# Altium schematic sheet 1 top.SchDoc
size A4; SheetNumber: 1; SheetTotal: 4
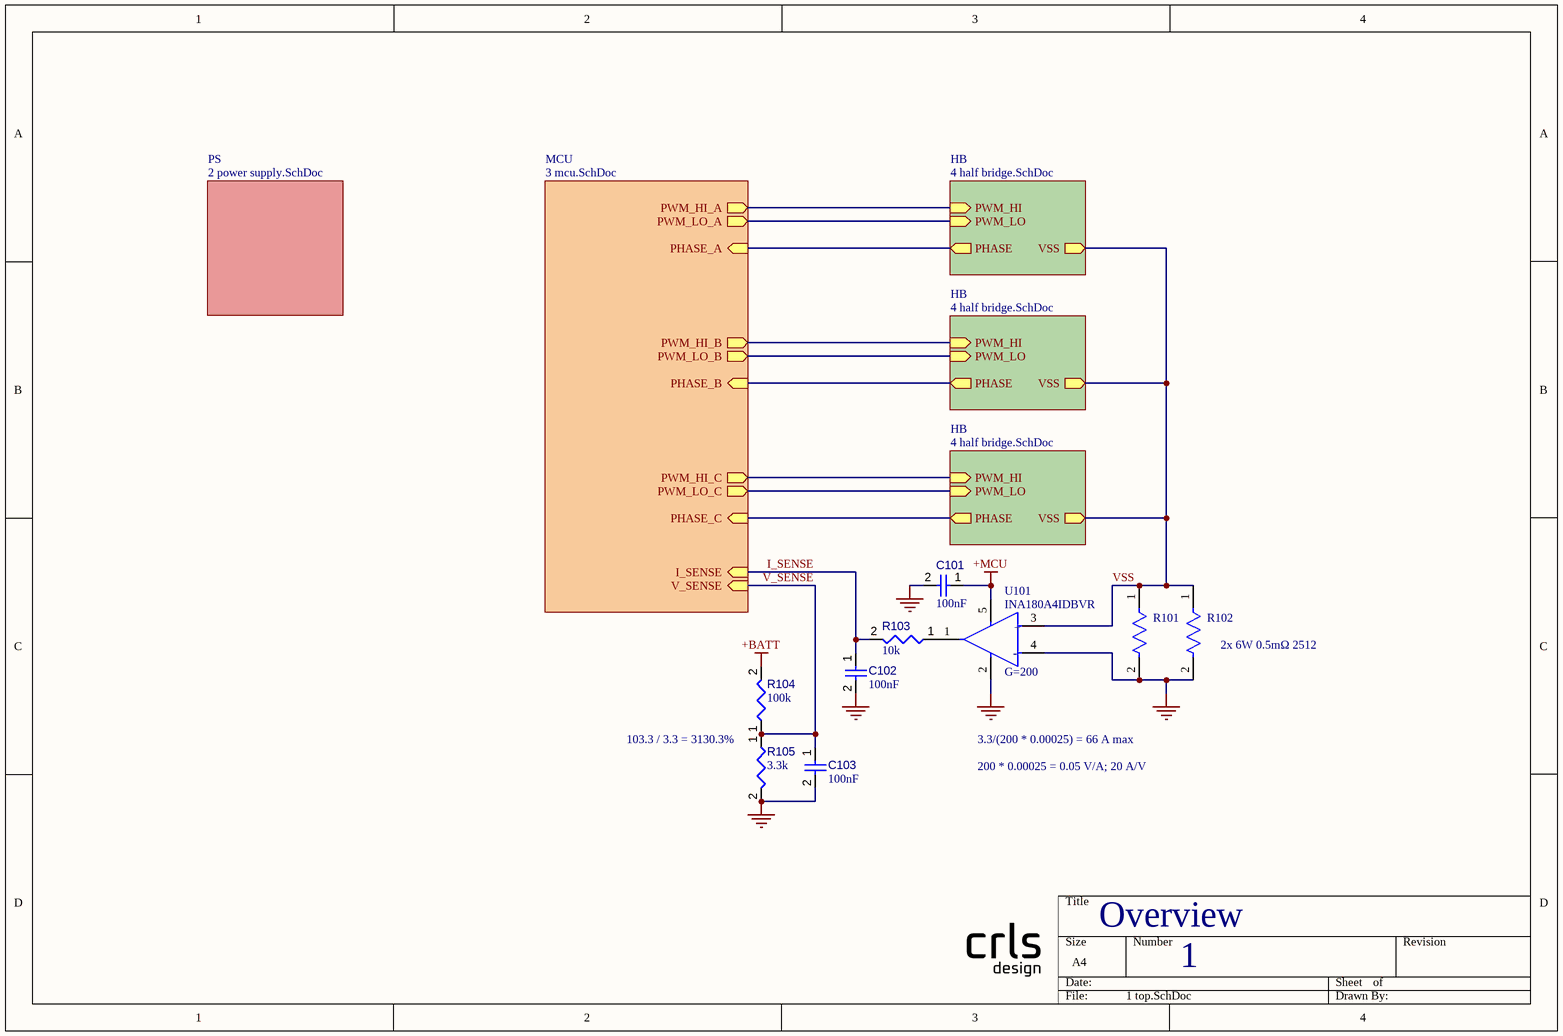
[diagram p0: 1 top.SchDoc]

## Parts
C101  value 100nF  [CAPC0402(1005)60_L]  (hidden comment: Capacitor 100nF +/-20% 25V 0402)
C102  value 100nF  [CAPC0402(1005)60_L]  (hidden comment: Capacitor 100nF +/-20% 25V 0402)
C103  value 100nF  [CAPC0402(1005)60_L]  (hidden comment: Capacitor 100nF +/-20% 25V 0402)
R101  PSL2NTEBL500F  [FP-PSL2NTEBL500F-MFG]  (value not drawn)
R102  PSL2NTEBL500F  [FP-PSL2NTEBL500F-MFG]  (value not drawn)
R103  value 10k  [RESC0402(1005)_L]  (hidden comment: Resistor 10K  +/-1 % 0402 63 mW)
R104  value 100k  [RESC0402(1005)_L]  (hidden comment: Resistor 100K +/-1 % 0402 63 mW)
R105  value 3.3k  [RESC0402(1005)_L]  (hidden comment: Resistor 3K3 +/-1 % 0402 63 mW)
U101  INA180A4IDBVR  [FP-DBV0005A-MFG]

## Sub-sheets
HB = 4 half bridge.SchDoc: PWM_HI (in), PWM_LO (in), PHASE (out), VSS (out)
HB = 4 half bridge.SchDoc: PWM_HI (in), PWM_LO (in), PHASE (out), VSS (out)
HB = 4 half bridge.SchDoc: PWM_HI (in), PWM_LO (in), PHASE (out), VSS (out)
MCU = 3 mcu.SchDoc: PHASE_A (in), PHASE_B (in), PHASE_C (in), PWM_HI_A (out), PWM_LO_A (out), PWM_HI_B (out), PWM_LO_B (out), PWM_HI_C (out), PWM_LO_C (out), V_SENSE (in), I_SENSE (in)
PS = 2 power supply.SchDoc: no entries

## Nets
+BATT: R104.2
+MCU: C101.1 U101.5(VS)
GND: C101.2 C102.2 C103.2 R101.2 R102.2 R105.2 U101.2(GND) U101.4(IN-)
I_SENSE: C102.1 R103.2 ; sheet MCU/I_SENSE
V_SENSE: C103.1 R104.1 R105.1 ; sheet MCU/V_SENSE
VSS: R101.1 R102.1 U101.3(IN+) ; sheet HB/VSS, sheet HB/VSS, sheet HB/VSS
NetR103_1: R103.1 U101.1(OUT)
(unnamed): sheet MCU/PHASE_A, sheet HB/PHASE
(unnamed): sheet MCU/PHASE_B, sheet HB/PHASE
(unnamed): sheet MCU/PHASE_C, sheet HB/PHASE
(unnamed): sheet MCU/PWM_HI_A, sheet HB/PWM_HI
(unnamed): sheet MCU/PWM_LO_A, sheet HB/PWM_LO
(unnamed): sheet MCU/PWM_HI_B, sheet HB/PWM_HI
(unnamed): sheet MCU/PWM_LO_B, sheet HB/PWM_LO
(unnamed): sheet MCU/PWM_HI_C, sheet HB/PWM_HI
(unnamed): sheet MCU/PWM_LO_C, sheet HB/PWM_LO

## Notes on the sheet
- (near R102) 2x 6W 0.5mΩ 2512
- (near U101) G=200
- (near R105) 103.3 / 3.3 = 3130.3%
- 3.3/(200 * 0.00025) = 66 A max
- 200 * 0.00025 = 0.05 V/A; 20 A/V
- Overview
- (in symbol CMP-04895-000244-1) +; -

## Library data of the parts
C101-C103 = CMP-001-00065-4: Chip Capacitor, 100nF +/-20%, 25V, 0402, Thickness 0.6 mm; Tolerance: 10%; Max Operating Temperature: 85°C; Min Operating Temperature: -55°C; Pins: 2; Voltage Rating: 25V; Mounting Technology: SMT; Case/Package: 0402
R101 R102 = CMP-04015-070281-1: RES 500 UOHM 1% 8W NONSTANDARD; RoHS Compliant: Yes
R103 = CMP-009-00149-3: Chip Resistor, 10 kOhms, +/-1 %, 63 mW, -55 to 125 degC, 0402; Power: 63mW; Tolerance: 1%; Min Operating Temperature: -55°C; Case/Package: 0402; Max Operating Temperature: 155°C; Pins: 2
R104 = CMP-009-00168-3: Chip Resistor, 100 kOhms, +/-1 %, 63 mW, -55 to 155 degC, 0402; Tolerance: 1%; Power: 63mW; Max Operating Temperature: 155°C; Min Operating Temperature: -55°C; Pins: 2; Case/Package: 0402
R105 = CMP-009-00145-3: Chip Resistor, 3.3 kOhms, +/-1 %, 63 mW, -55 to 155 degC, 0402; Tolerance: 1%; Power: 63mW; Case/Package: 0402; Min Operating Temperature: -55°C; Max Operating Temperature: 155°C; Pins: 2
U101 = CMP-04895-000244-1: IC CURR SENSE 1 CIRCUIT SOT23-5; Operating Supply Current: 260uA; Number of Circuits: 1; Input Bias Current: 100nA; -3db Bandwidth: 350kHz; Input Offset Voltage (Vos): 100uV; Slew Rate: 2V/µs; Case/Package: SOT-23-5; Min Operating Temperature: -40°C; Packaging: Tape and Reel; Max Operating Temperature: 125°C; Mount: Surface Mount; RoHS Compliant: Yes